# EAGLE design conectores (EAGLE 6.5.0)
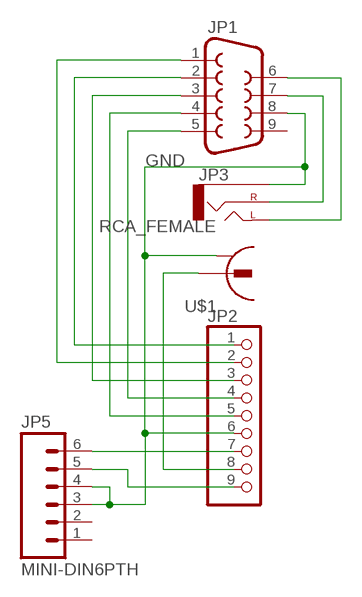
[diagram p0: schematic, sheet 1]

## Parts
JP1  DB9MALE  [DB9_MALE]
JP2  PINHD-1X9  [1X09]
JP3  AUDIO-JACKPTH  [AUDIO-JACK]
JP5  MINI-DIN6PTH  [MINI-DIN6]
U$1  RCA_FEMALE  [RCA_EBAY]

## Nets
GND: JP1.8 JP2.6 JP3.SLEEVE JP5.3 JP5.4 U$1.1
N$1: JP1.1 JP2.2
N$2: JP1.2 JP2.1
N$3: JP1.3 JP2.3
N$4: JP1.4 JP2.5
N$5: JP1.5 JP2.4
N$6: JP1.6 JP3.TIP(LEFT)
N$7: JP1.7 JP3.RING(RIGHT)
N$9: JP2.9 JP5.5
N$10: JP2.8 U$1.2
N$11: JP2.7 JP5.6
Unconnected: JP1.9 JP5.1 JP5.2

## Library data of the parts
JP1 = SparkFun-Connectors:DB9: DB9 Connector Standard DB9 (D-Sub 9) serial connector. Can be used for CAN bus as well as RS485 and RS232. Footprint production proven. Spark Fun Electronics SKU : PRT-00429
JP2 = pinhead:PINHD-1X9: PIN HEADER
JP3 = SparkFun-Connectors:AUDIO-JACK: 3.5mm Audio Jack Simple 3.5mm common PCB mount audio jack. SKU: PRT-08032
JP5 = SparkFun-Connectors:MINI-DIN6: mini DIN 6 Connector Commonly found on the back of a computer for PS2 keyboard and mice. Schematic and footprint are proven. Spark Fun Electronics SKU : PRT-08509
U$1 = Mio:RCA_FEMALE

## Board
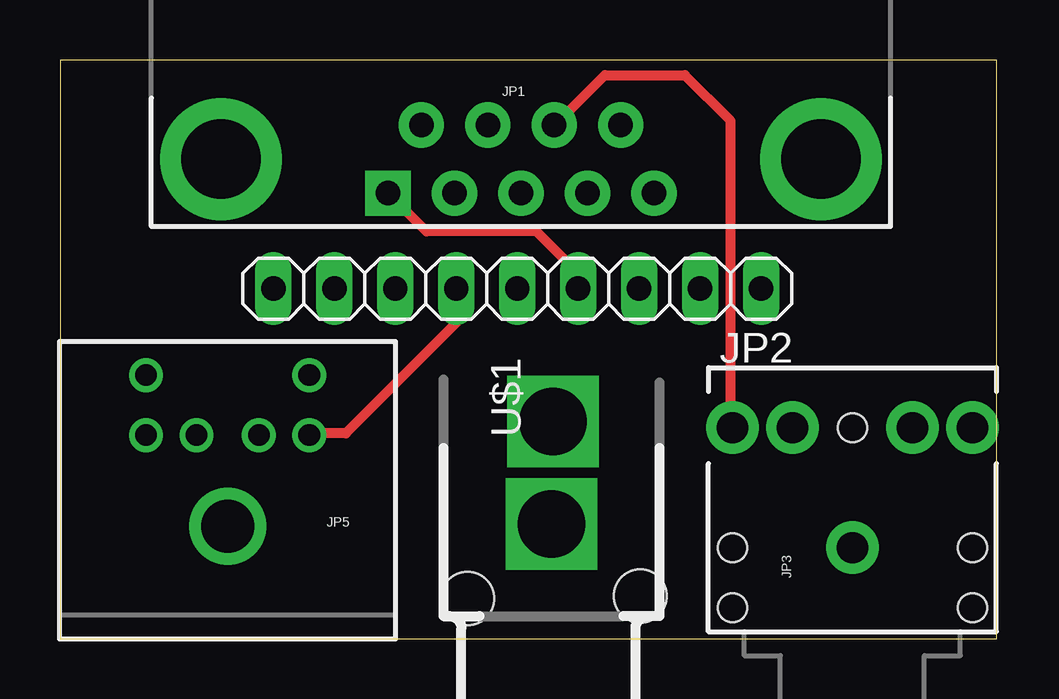
[diagram p1: board, top side]
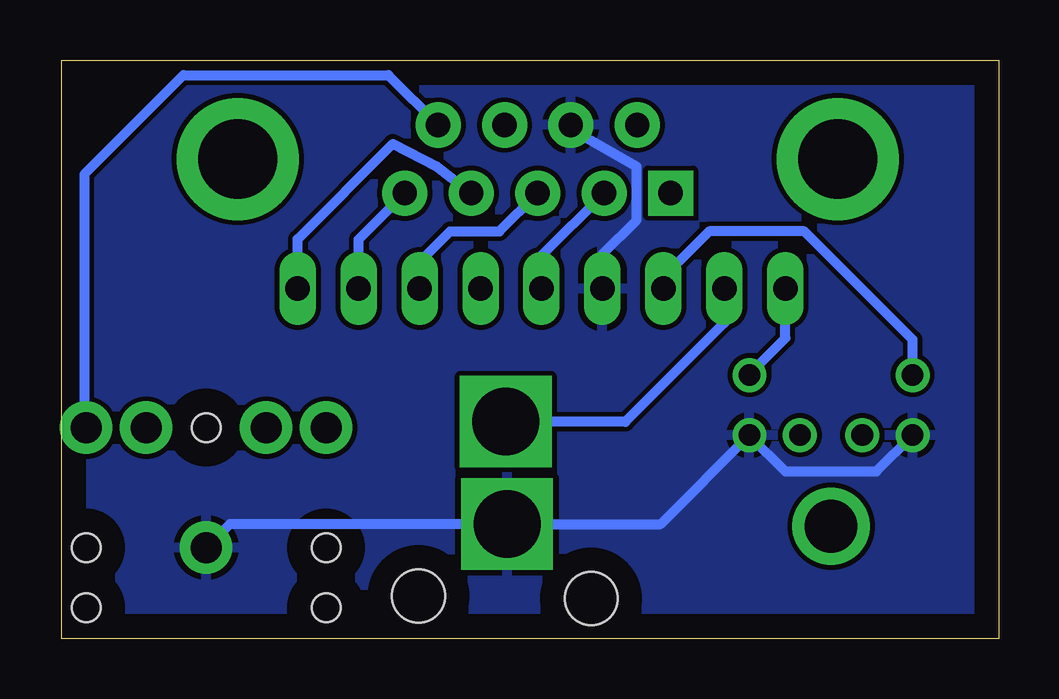
[diagram p2: board, bottom side, seen from below]

Size 39.04 x 24.11 mm. Coordinates in mm from the lower left corner, seen from the top.
Outline: 0,24.11 0,0 39.04,0 39.04,24.11 0,24.11
Copper layers (1*16): Top 0.035mm / dielectric 1.5mm / Bottom 0.035mm
Design rules "default": minimum track width 10mil, minimum drill 24mil, track to track 8mil, track to pad 8mil, pad to pad 8mil, via to via 8mil, smd to smd 8mil, copper to edge 40mil, drill to drill 8mil, minimum pad ring 10mil, minimum via ring 8mil, stop-mask expansion 4mil, vias tented up to drill 0mil, thermal gap 10mil

### Footprints (pad centres in the part's own frame; a part is rotated, then mirrored left to right if it is on the bottom)
DB9_MALE = drill 1.016 pad 1.88: 1 5.54,-1.42; 2 2.77,-1.42; 3 0,-1.42; 4 -2.77,-1.42; 6 4.15,1.42; 7 1.38,1.42; 8 -1.38,1.42; 9 -4.15,1.42 | drill 1.016 pad 1.88 square: 5 -5.54,-1.42 | drill 3.302 pad 5.08: G1 -12.5,0; G2 12.5,0
1X09 = drill 1.016 long: 1 -10.16,0; 2 -7.62,0; 3 -5.08,0; 4 -2.54,0; 5 0,0; 6 2.54,0; 7 5.08,0; 8 7.62,0; 9 10.16,0
AUDIO-JACK = drill 1.3 pad 2.184: RING 5,5; RSH 5,2.5; SLEEVE 0,0; TIP 5,-5; TSH 5,-2.5 | hole 1.2: 0,5; -2.5,5; -2.5,-5; 0,-5; 5,0
MINI-DIN6 = drill 0.9: 1 -1.3,-8.5; 2 1.3,-8.5; 3 -3.4,-8.5; 4 3.4,-8.5; 5 -3.4,-11; 6 3.4,-11 | drill 2.2: P$1 0,-4.7
RCA_EBAY = drill 2.8 pad 3.556 square: 1 4,0; 2 8.27,-0.06 | hole 2.2: 0.9,3.5; 1,-3.7

### Placement (x,y rotation side)
JP1  19.21,19.98 0 top
JP2  19.05,14.59 180 top
JP3  33.02,3.79 90 top
JP5  6.99,-0.02 180 top
U$1  20.48,0.77 90 top

### Tracks (layer width: path | path; a pad name or v marks a point on that pad's centre or on a via)
GND
  Top 0.406: JP2.6 16.51,13.16 11.91,8.55 10.46,8.55 JP5.3
  Bottom 0.406: JP5.4 5.1,6.97 8.89,6.97 10.38,8.46 JP5.3 14.09,4.77 U$1.1 32.04,4.77 JP3.SLEEVE | JP2.6 16.51,16.01 15.08,17.44 15.08,19.66 17.3,20.93 17.82,21.41 JP1.8
  pour Bottom: 0.48,23.79 38.73,23.79 38.73,0.3 0.32,0.3 0.32,23.95 0.48,23.95
N$1
  Bottom 0.406: JP2.2 26.67,16.64 JP1.1
N$2
  Bottom 0.406: JP2.1 29.21,16.65 25.24,20.62 23.4,19.66 JP1.2
N$3
  Bottom 0.406: JP2.3 24.13,15.7 22.86,16.97 20.8,16.97 JP1.3
N$4
  Bottom 0.406: JP2.5 19.05,15.95 JP1.4
N$5
  Top 0.406: JP2.4 21.59,15.22 19.84,16.97 15.27,16.97 JP1.5
N$6
  Bottom 0.406: JP3.TIP 38.1,8.87 38.1,19.35 33.97,23.48 25.43,23.48 JP1.6
N$7
  Top 0.406: JP3.RING 27.94,8.87 27.94,21.57 26.04,23.48 22.7,23.48 20.63,21.4 JP1.7
N$9
  Bottom 0.406: JP5.5 10.38,11.03 8.89,12.52 JP2.9
N$10
  Bottom 0.406: JP2.8 11.43,13.16 15.56,9.03 20.52,9.03 U$1.2
N$11
  Bottom 0.406: JP5.6 3.58,12.46 8.1,16.97 12.06,16.97 13.97,15.06 JP2.7